# Altium project wisp-6.0V2.PrjPcb
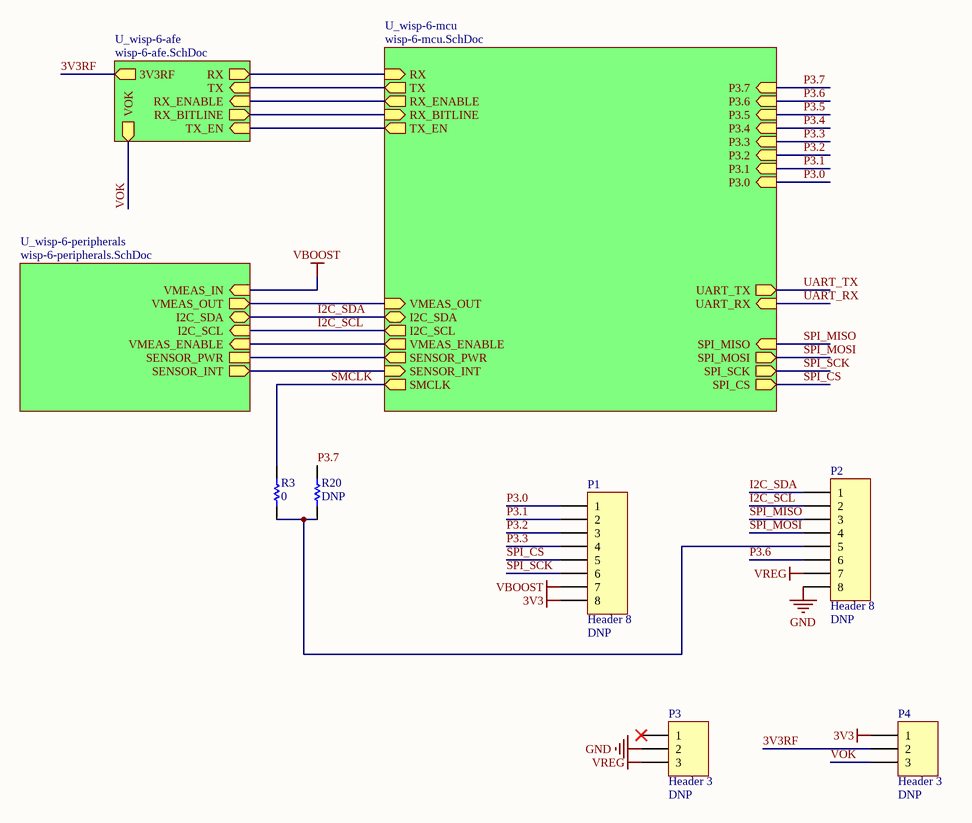
[diagram p0: wisp-6-main.SchDoc]
4 sheets, 84 parts. Net scope: hierarchical (ports join the sheet entries above them; power ports are global).
Board file: wisp-6-dipole.PcbDoc
Sheets:
  wisp-6-main.SchDoc
    U_wisp-6-mcu = wisp-6-mcu.SchDoc
    U_wisp-6-afe = wisp-6-afe.SchDoc
    U_wisp-6-peripherals = wisp-6-peripherals.SchDoc

## Sheet wisp-6-main.SchDoc: WISP-6.0
size B; SheetNumber: 1; SheetTotal: 4

### Parts
P1  Header 8  value DNP  [HDR1X8]
P2  Header 8  value DNP  [HDR1X8]
P3  Header 3  value DNP  [HDR1X3]
P4  Header 3  value DNP  [HDR1X3]
R3  value 0  [0402]  (hidden comment: Generic resistor)
R20  value DNP  [0402]  (hidden comment: Generic resistor)

### Sub-sheets
U_wisp-6-afe = wisp-6-afe.SchDoc: TX (in), RX_ENABLE (in), RX (out), RX_BITLINE (out), TX_EN (in), VOK (out), 3V3RF (out)
U_wisp-6-mcu = wisp-6-mcu.SchDoc: RX (in), TX (out), RX_ENABLE (out), VMEAS_ENABLE (out), I2C_SCL (out), I2C_SDA (bidir), VMEAS_OUT (in), P3.0 (in), P3.1 (in), P3.2 (in), P3.3 (in), P3.4 (in), P3.5 (in), P3.6 (in), P3.7 (in), SPI_CS (out), RX_BITLINE (in), UART_RX (in), UART_TX (out), SPI_SCK (out), SENSOR_PWR (out), SENSOR_INT (in), TX_EN (out), SMCLK (out), SPI_MISO (in), SPI_MOSI (out)
U_wisp-6-peripherals = wisp-6-peripherals.SchDoc: VMEAS_IN (in), VMEAS_OUT (out), VMEAS_ENABLE (in), I2C_SCL (in), I2C_SDA (bidir), SENSOR_INT (out), SENSOR_PWR

### Nets
3V3: P1.8 P4.1
3V3RF: P4.2 ; sheet U_wisp-6-afe/3V3RF
GND: P2.8 P3.2
SENSOR_PWR: sheet U_wisp-6-mcu/SENSOR_PWR, sheet U_wisp-6-peripherals/SENSOR_PWR
VBOOST: P1.7 ; sheet U_wisp-6-peripherals/VMEAS_IN
VREG: P2.7 P3.3
BITLINE: sheet U_wisp-6-mcu/RX_BITLINE, sheet U_wisp-6-afe/RX_BITLINE
I2C_SCL: P2.2 ; sheet U_wisp-6-mcu/I2C_SCL, sheet U_wisp-6-peripherals/I2C_SCL
I2C_SDA: P2.1 ; sheet U_wisp-6-mcu/I2C_SDA, sheet U_wisp-6-peripherals/I2C_SDA
P3.0: P1.1 ; sheet U_wisp-6-mcu/P3.0
P3.1: P1.2 ; sheet U_wisp-6-mcu/P3.1
P3.2: P1.3 ; sheet U_wisp-6-mcu/P3.2
P3.3: P1.4 ; sheet U_wisp-6-mcu/P3.3
P3.6: P2.6 ; sheet U_wisp-6-mcu/P3.6
P3.7: R20.2 ; sheet U_wisp-6-mcu/P3.7
RX: sheet U_wisp-6-mcu/RX, sheet U_wisp-6-afe/RX
SMCLK: R3.2 ; sheet U_wisp-6-mcu/SMCLK
SPI_CS: P1.5 ; sheet U_wisp-6-mcu/SPI_CS
SPI_MISO: P2.3 ; sheet U_wisp-6-mcu/SPI_MISO
SPI_MOSI: P2.4 ; sheet U_wisp-6-mcu/SPI_MOSI
SPI_SCK: P1.6 ; sheet U_wisp-6-mcu/SPI_SCK
VOK: P4.3 ; sheet U_wisp-6-afe/VOK  [project net V_BATOK_RF]
NetC11_2: sheet U_wisp-6-mcu/RX_ENABLE, sheet U_wisp-6-afe/RX_ENABLE
NetP2_5: P2.5 R3.1 R20.1
NetR24_2: sheet U_wisp-6-mcu/VMEAS_ENABLE, sheet U_wisp-6-peripherals/VMEAS_ENABLE
NetR25_1: sheet U_wisp-6-mcu/VMEAS_OUT, sheet U_wisp-6-peripherals/VMEAS_OUT
NetR27_2: sheet U_wisp-6-mcu/TX_EN, sheet U_wisp-6-afe/TX_EN
NetR28_1: sheet U_wisp-6-mcu/TX, sheet U_wisp-6-afe/TX
NetU4_16: sheet U_wisp-6-mcu/SENSOR_INT, sheet U_wisp-6-peripherals/SENSOR_INT

Not connected (* = marked no-connect by the designer): P3 1*

### Library data of the parts
P1 P2 = Header 8: Header, 8-Pin; LatestRevisionDate: 17-Jul-2002; LatestRevisionNote: Re-released for DXP Platform.; Publisher: Altium Limited
P3 P4 = Header 3: Header, 3-Pin; LatestRevisionDate: 17-Jul-2002; LatestRevisionNote: Re-released for DXP Platform.; Publisher: Altium Limited
R3 = R-0-0.063W-*-0402: RES 0 OHM JUMPER 1/16W 0402; Manufacturer: YAGEO; Manufacturer Part Number: RC0402JR-070RL; Digi-Key Part Number: 311-0.0JRCT-ND; Rating: 1/16W; Note: *; Tolerance: *
R20 = res: Chip Resistor (Surface Mount); Manufacturer: *; Manufacturer Part Number: *; Digi-Key Part Number: *; Rating: *; Note: *; Tolerance: *

## Sheet wisp-6-mcu.SchDoc: MCU
size B; SheetNumber: 2; SheetTotal: 4
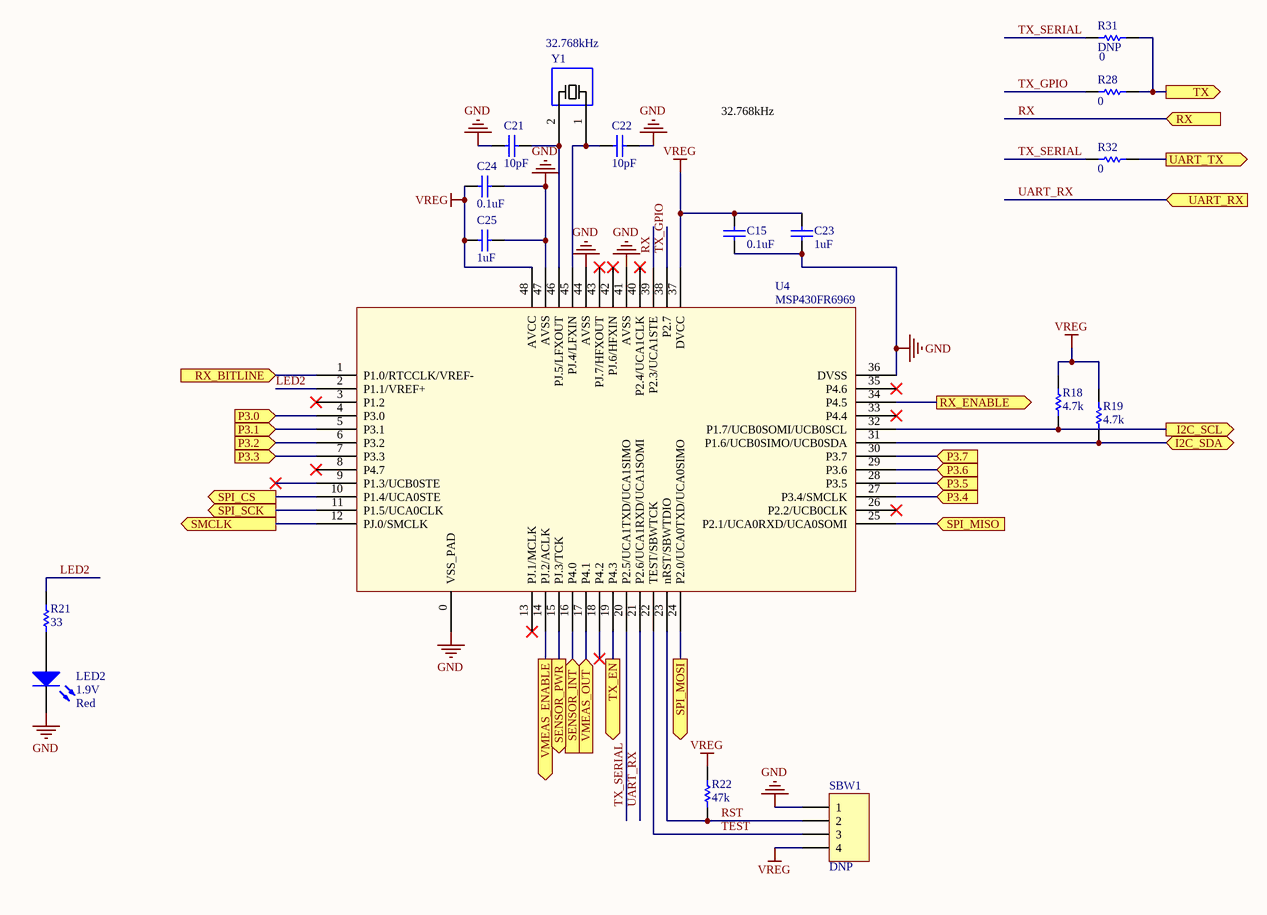
[diagram p1: wisp-6-mcu.SchDoc]

### Parts
C15  value 0.1uF  [0402]  (hidden comment: Generic ceramic capacitor)
C21  value 10pF  [0402]  (hidden comment: Generic ceramic capacitor)
C22  value 10pF  [0402]  (hidden comment: Generic ceramic capacitor)
C23  value 1uF  [0402]  (hidden comment: Generic ceramic capacitor)
C24  value 0.1uF  [0402]  (hidden comment: Generic ceramic capacitor)
C25  value 1uF  [0402]  (hidden comment: Generic ceramic capacitor)
LED2  value 1.9V  Color: Red  [Diode - 0603]  (hidden comment: Generic LED)
R18  value 4.7k  [0402]  (hidden comment: Generic resistor)
R19  value 4.7k  [0402]  (hidden comment: Generic resistor)
R21  value 33  [0402]  (hidden comment: Generic resistor)
R22  value 47k  [0402]  (hidden comment: Generic resistor)
R28  value 0  [0402]  (hidden comment: Generic resistor)
R31  value DNP  Note: 0  [0402]  (hidden comment: Generic resistor)
R32  value 0  [0402]  (hidden comment: Generic resistor)
SBW1  value DNP  [MHDR1X4]  (hidden comment: MHDR1X4)
U4  MSP430FR6969  [MSP_QFN48_RGZ_PAD0]
Y1  value 32.768kHz  [XTAL [3.20mm x 1.50mm]]  (hidden comment: XTAL 2 pin)

### Ports
I2C_SCL (out), I2C_SDA (bidir), P3.0 (in), P3.1 (in), P3.2 (in), P3.3 (in), P3.4 (in), P3.5 (in), P3.6 (in), P3.7 (in), RX (in), RX_BITLINE (in), RX_ENABLE (out), SENSOR_INT (in), SENSOR_PWR (out), SMCLK (out), SPI_CS (out), SPI_MISO (in), SPI_MOSI (out), SPI_SCK (out), TX (out), TX_EN (out), UART_RX (in), UART_TX (out), VMEAS_ENABLE (out), VMEAS_OUT (in)

### Nets
GND: C15.1 C21.1 C22.2 C23.1 C24.2 C25.2 LED2.2(K) SBW1.1 U4.0(VSS_PAD) U4.36(DVSS) U4.41(AVSS) U4.44(AVSS) U4.47(AVSS)
SENSOR_PWR: U4.15(PJ.3/TCK) ; port SENSOR_PWR
VREG: C15.2 C23.2 C24.1 C25.1 R18.2 R19.2 R22.2 SBW1.4 U4.37(DVCC) U4.48(AVCC)
BITLINE: U4.1(P1.0/RTCCLK/VREF-) ; port RX_BITLINE
I2C_SCL: R18.1 U4.32(P1.7/UCB0SOMI/UCB0SCL) ; port I2C_SCL
I2C_SDA: R19.1 U4.31(P1.6/UCB0SIMO/UCB0SDA) ; port I2C_SDA
LED2: R21.2 U4.2(P1.1/VREF+)
P3.0: U4.4(P3.0) ; port P3.0
P3.1: U4.5(P3.1) ; port P3.1
P3.2: U4.6(P3.2) ; port P3.2
P3.3: U4.7(P3.3) ; port P3.3
P3.4: U4.27(P3.4/SMCLK) ; port P3.4
P3.5: U4.28(P3.5) ; port P3.5
P3.6: U4.29(P3.6) ; port P3.6
P3.7: U4.30(P3.7) ; port P3.7
RST: R22.1 SBW1.2 U4.23(nRST/SBWTDIO)
RX: U4.39(P2.3/UCA1STE) ; port RX
SMCLK: U4.12(PJ.0/SMCLK) ; port SMCLK
SPI_CS: U4.10(P1.4/UCA0STE) ; port SPI_CS
SPI_MISO: U4.25(P2.1/UCA0RXD/UCA0SOMI) ; port SPI_MISO
SPI_MOSI: U4.24(P2.0/UCA0TXD/UCA0SIMO) ; port SPI_MOSI
SPI_SCK: U4.11(P1.5/UCA0CLK) ; port SPI_SCK
TEST: SBW1.3 U4.22(TEST/SBWTCK)
TX_GPIO: R28.2 U4.38(P2.7)
TX_SERIAL: R31.2 R32.2 U4.20(P2.5/UCA1TXD/UCA1SIMO)
UART_RX: U4.21(P2.6/UCA1RXD/UCA1SOMI) ; port UART_RX
UART_TX: R32.1 ; port UART_TX
NetC11_2: U4.34(P4.5) ; port RX_ENABLE
NetC21_2: C21.2 U4.46(PJ.5/LFXOUT) Y1.2
NetC22_1: C22.1 U4.45(PJ.4/LFXIN) Y1.1
NetLED2_1: LED2.1(A) R21.1
NetR24_2: U4.14(PJ.2/ACLK) ; port VMEAS_ENABLE
NetR25_1: U4.17(P4.1) ; port VMEAS_OUT
NetR27_2: U4.19(P4.3) ; port TX_EN
NetR28_1: R28.1 R31.1 ; port TX
NetU4_16: U4.16(P4.0) ; port SENSOR_INT

Not connected (* = marked no-connect by the designer): U4 3(P1.2)* 8(P4.7)* 9(P1.3/UCB0STE)* 13(PJ.1/MCLK)* 18(P4.2)* 26(P2.2/UCB0CLK)* 33(P4.4)* 35(P4.6)* 40(P2.4/UCA1CLK)* 42(PJ.6/HFXIN)* 43(PJ.7/HFXOUT)*

### Notes on the sheet
- 32.768kHz

### Library data of the parts
C15 C24 = C-0.1uF-10V-X5R-0402: CAP CER 100nF/0.1UF 10V X5R 0402; Manufacturer: Samsung Electro-Mechanics; Manufacturer Part Number: CL05A104KP5NNNC; Rating: 10V, -55C~85C; Tolerance: +-10%; Digi-Key Part Number: 1276-1022-1-ND; Note: *
C21 C22 = C-10pF-50V-C0G-0402: CAP CER 10PF 50V C0G/NP0 0402; Manufacturer: Samsung Electro-Mechanics; Manufacturer Part Number: CL05C100DB5NNNC; Rating: 10V, -55~125C; Tolerance: +-0.5pF; Digi-Key Part Number: 1276-1625-1-ND; Note: *
C23 C25 = C-1uF-10V-X5R-0402: CAP CER 1UF 10V X5R 0402; Manufacturer: Samsung Electro-Mechanics; Manufacturer Part Number: CL05A105KP5NNNC; Rating: 10V, -55~85C; Tolerance: +-10%; Digi-Key Part Number: 1276-1076-1-ND; Note: *
LED2 = led-red-1V9-0603: Red 629nm LED Indication - Discrete 1.9V 0603 (1608 Metric); Manufacturer: Lite-On Inc.; Manufacturer Part Number: LTST-C193KRKT-2A; Rating: 2A; Digi-Key Part Number: 160-1909-1-ND; Note: *; Tolerance: *
R18 R19 = R-4k7-0.063W-5%-0402: RES 4.7K OHM 5% 1/16W 0402; Manufacturer: YAGEO; Manufacturer Part Number: RC0402JR-074K7L; Tolerance: +-5%; Digi-Key Part Number: 311-4.7KJRCT-ND; Rating: 1/16W; Note: *
R21 = R-33-0.063W-5%-0402: 33 Ohms ±5% 0.063W, 1/16W Chip Resistor 0402 (1005 Metric) Moisture Resistant Thick Film; Manufacturer: YAGEO; Manufacturer Part Number: RC0402JR-1333RL; Tolerance: +-5%; Digi-Key Part Number: 13-RC0402JR-1333RLCT-ND; Rating: 1/16W; Note: *
R22 = R-47k-0.063W-5%-0402: RES 47K OHM 5% 1/16W 0402; Manufacturer: YAGEO; Manufacturer Part Number: RC0402JR-1047KL; Tolerance: +-5%; Digi-Key Part Number: 13-RC0402JR-1047KLCT-ND; Rating: 1/16W; Note: *
R28 R31 R32 = R-0-0.063W-*-0402: as R3 on sheet wisp-6-main; Digi-Key Part Number: 311-0.0JRCT-ND; Rating: 1/16W; Tolerance: *
  R28 R32: Note: 0
SBW1 = MHDR1X4: Header, 4-Pin; LatestRevisionDate: 17-Jul-2002; LatestRevisionNote: Re-released for DXP Platform.; Publisher: Altium Limited
U4 = MSP430FR596X_586X_RGZ: MSP430 CPUXV2 MSP430™ FRAM Microcontroller IC 16-Bit 16MHz 64KB (64K x 8) FRAM 48-VQFN (7x7); Manufacturer Part Number: MSP430FR5969IRGZT; Manufacturer: Texas Instruments; Rating: -40~85C; Digi-Key Part Number: 296-37918-1-ND; Note: *
Y1 = XTAL_2pin: 2-pin XTAL; Manufacturer Part Number: FC-135 32.7680KA-A3; Digi-Key Part Number: *; Manufacturer: *; Rating: *; Note: *

## Sheet wisp-6-afe.SchDoc: AFE
size B; SheetNumber: 3; SheetTotal: 4
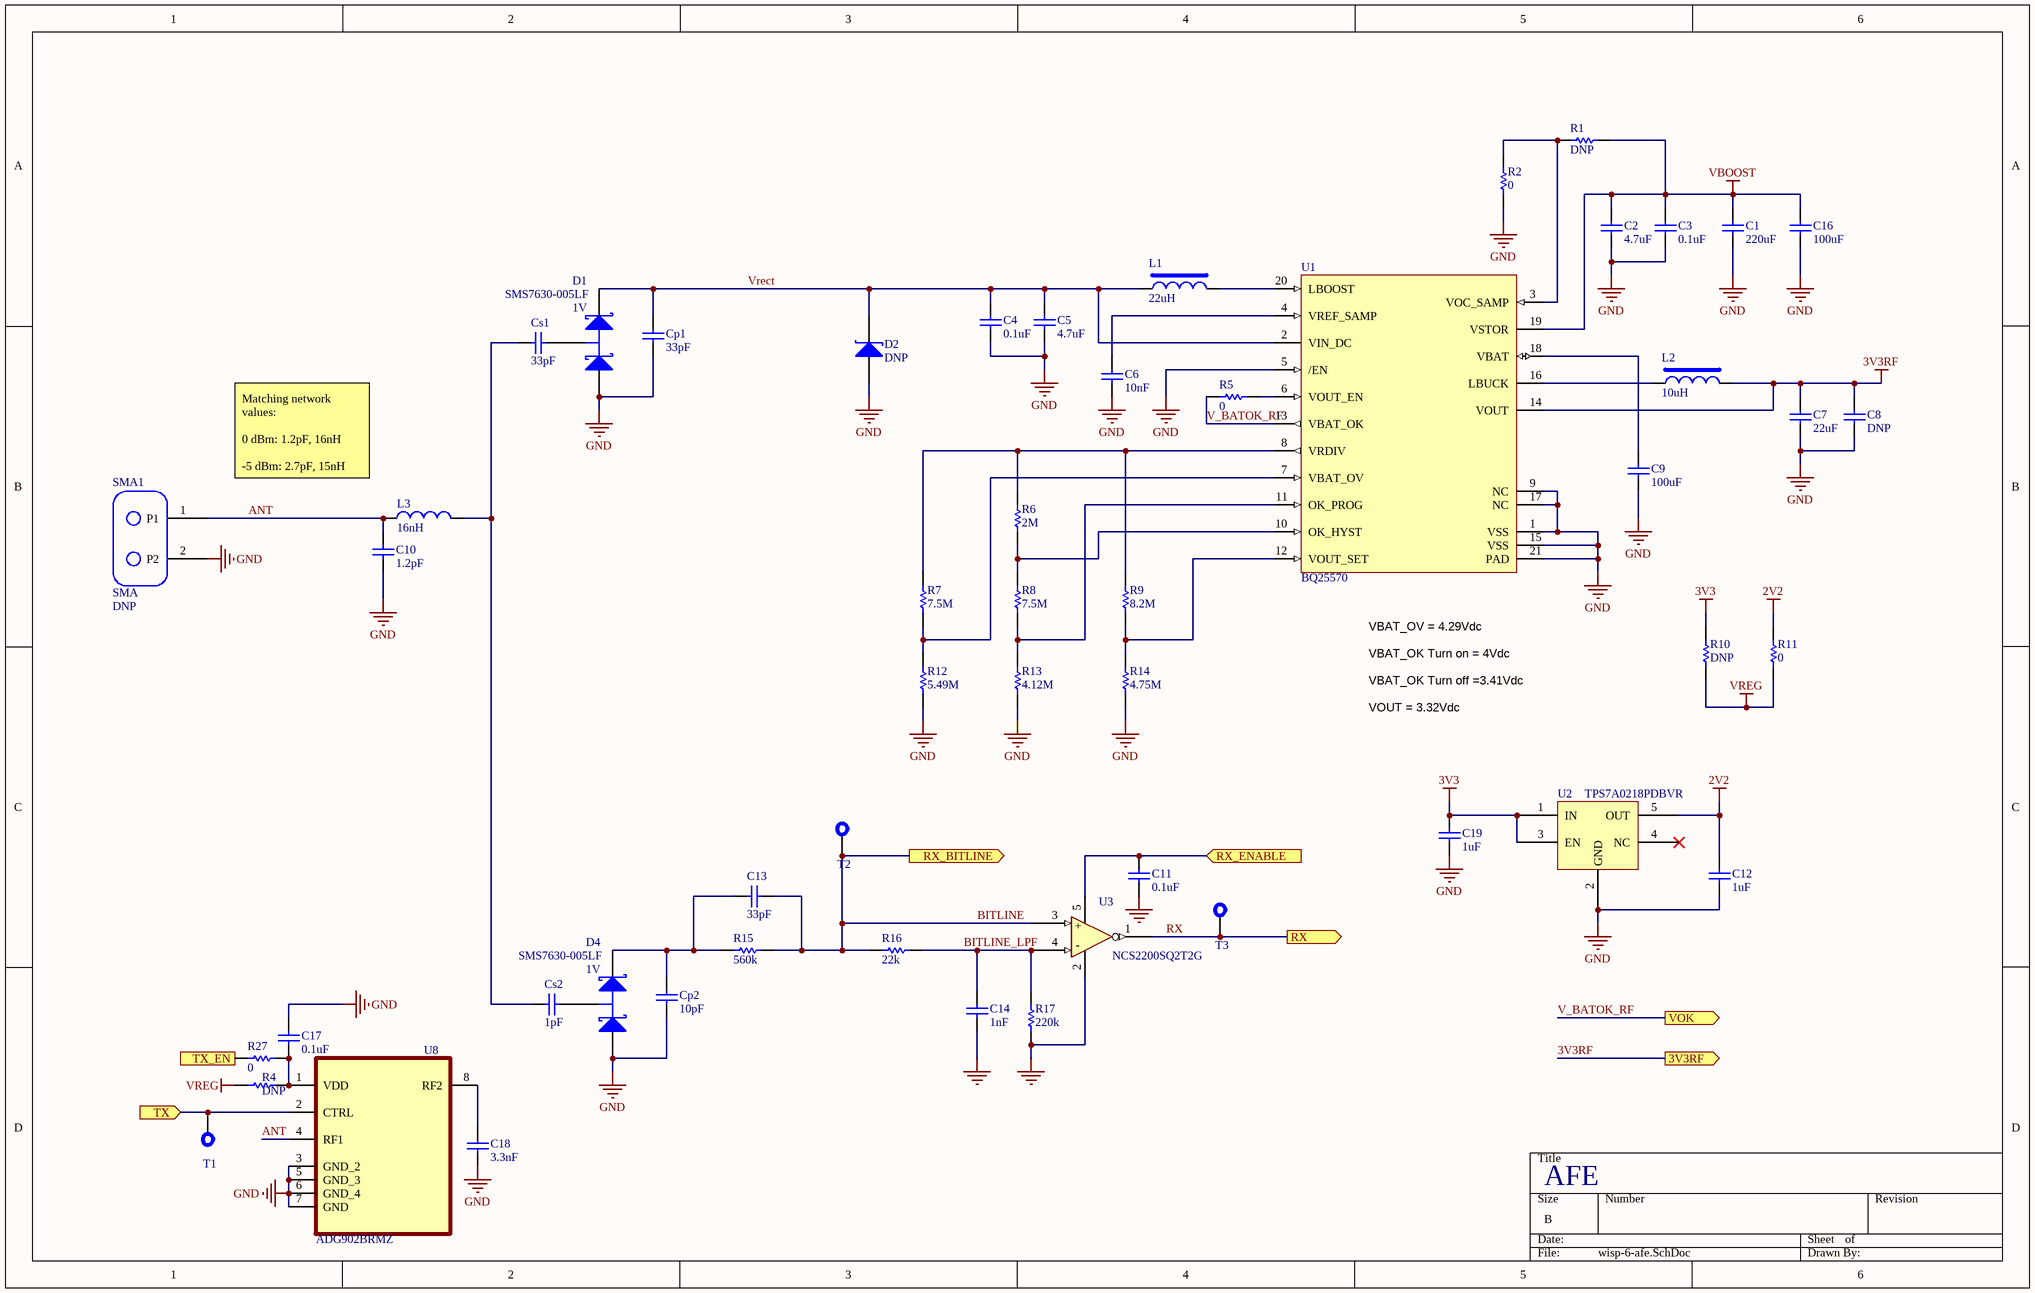
[diagram p2: wisp-6-afe.SchDoc]

### Parts
C1  value 220uF  [1206]  (hidden comment: Generic ceramic capacitor)
C2  value 4.7uF  [0402]  (hidden comment: Generic ceramic capacitor)
C3  value 0.1uF  [0402]  (hidden comment: Generic ceramic capacitor)
C4  value 0.1uF  [0402]  (hidden comment: Generic ceramic capacitor)
C5  value 4.7uF  [0402]  (hidden comment: Generic ceramic capacitor)
C6  value 10nF  [0402]  (hidden comment: Generic ceramic capacitor)
C7  value 22uF  [0402]  (hidden comment: Generic ceramic capacitor)
C8  value DNP  [0402]  (hidden comment: Generic capacitor)
C9  value 100uF  [0805]  (hidden comment: Generic ceramic capacitor)
C10  value 1.2pF  [0402]  (hidden comment: Generic capacitor)
C11  value 0.1uF  [0402]  (hidden comment: Generic ceramic capacitor)
C12  value 1uF  [0402]  (hidden comment: Generic ceramic capacitor)
C13  value 33pF  [0402]  (hidden comment: Generic capacitor)
C14  value 1nF  [0402]  (hidden comment: Generic ceramic capacitor)
C16  value 100uF  [0805]  (hidden comment: Generic ceramic capacitor)
C17  value 0.1uF  [0402]  (hidden comment: Generic ceramic capacitor)
C18  value 3.3nF  [0402]  (hidden comment: Generic capacitor)
C19  value 1uF  [0402]  (hidden comment: Generic ceramic capacitor)
Cp1  value 33pF  [0402]  (hidden comment: Generic capacitor)
Cp2  value 10pF  [0402]  (hidden comment: Generic capacitor)
Cs1  value 33pF  [0402]  (hidden comment: Generic capacitor)
Cs2  value 1pF  [0402]  (hidden comment: Generic capacitor)
D1  SMS7630-005LF  value 1V  [SOT23 - N]
D2  value DNP  [Zener_SOD-523]  (hidden comment: Generic diode - zener)
D4  SMS7630-005LF  value 1V  [SOT23 - N]
L1  value 22uH  [LPS4018]  (hidden comment: SMT shielded inductor)
L2  value 10uH  [IND1008]  (hidden comment: SMT shielded inductor)
L3  value 16nH  [0603]  (hidden comment: Generic inductor)
R1  value DNP  [0402]  (hidden comment: Generic resistor)
R2  value 0  [0402]  (hidden comment: Generic resistor)
R4  value DNP  [0402]  (hidden comment: Generic resistor)
R5  value 0  [0402]  (hidden comment: Generic resistor)
R6  value 2M  [0402]  (hidden comment: Generic resistor)
R7  value 7.5M  [0402]  (hidden comment: Generic resistor)
R8  value 7.5M  [0402]  (hidden comment: Generic resistor)
R9  value 8.2M  [0402]  (hidden comment: Generic resistor)
R10  value DNP  [0402]  (hidden comment: Generic resistor)
R11  value 0  [0402]  (hidden comment: Generic resistor)
R12  value 5.49M  [0402]  (hidden comment: Generic resistor)
R13  value 4.12M  [0402]  (hidden comment: Generic resistor)
R14  value 4.75M  [0402]  (hidden comment: Generic resistor)
R15  value 560k  [0402]  (hidden comment: Generic resistor)
R16  value 22k  [0402]  (hidden comment: Generic resistor)
R17  value 220k  [0402]  (hidden comment: Generic resistor)
R27  value 0  [0402]  (hidden comment: Generic resistor)
SMA1  SMA  value DNP  [SMA - Hole - 2 Pin]
T1  TP  [Test Point - Via]  (value not drawn)  (no BOM)
T2  TP  [Test Point - Via]  (value not drawn)  (no BOM)
T3  TP  [Test Point - Via]  (value not drawn)  (no BOM)
U1  BQ25570  [BQ25570]
U2  TPS7A0218PDBVR  [SOT23-5]
U3  NCS2200SQ2T2G  [SC70-5]
U8  ADG902BRMZ  [SOP65P490X110-8N]

### Ports
3V3RF (out), RX (out), RX_BITLINE (out), RX_ENABLE (in), TX (in), TX_EN (in), VOK (out)

### Nets
2V2: C12.2 R11.2 U2.5(OUT)
3V3: C19.2 R10.2 U2.1(IN) U2.3(EN)
3V3RF: C7.2 C8.2 L2.2 U1.14(VOUT) ; port 3V3RF
GND: C1.1 C2.1 C3.1 C4.1 C5.1 C6.1 C7.1 C8.1 C9.1 C10.1 C11.1 C12.1 C14.1 C16.1 C17.2 C18.1 C19.1 Cp1.2 Cp2.2 D1.1(A) D2.1(A) D4.1(A) R2.1 R12.1 R13.1 R14.1 R17.1 SMA1.2(P2) U1.1(VSS) U1.5(/EN) U1.9(NC) U1.15(VSS) U1.17(NC) U1.21(PAD) U2.2(GND) U3.2(Gnd) U8.3(GND_2) U8.5(GND_3) U8.6(GND_4) U8.7(GND)
VBOOST: C1.2 C2.2 C3.2 C16.2 R1.2 U1.19(VSTOR)
VREG: R4.2 R10.1 R11.1
ANT: C10.2 L3.1 SMA1.1(P1) U8.4(RF1)
BITLINE: C13.1 R15.2 R16.1 T2.0 U3.3(IN+) ; port RX_BITLINE
BITLINE_LPF: C14.2 R16.2 R17.2 U3.4(In-)
RX: T3.0 U3.1(OUT) ; port RX
V_BATOK_RF: R5.1 U1.13(VBAT_OK) ; port VOK
Vrect: C4.2 C5.2 Cp1.1 D1.2(K) D2.2(K) L1.1 U1.2(VIN_DC)
NetC6_2: C6.2 U1.4(VREF_SAMP)
NetC9_2: C9.2 U1.18(VBAT)
NetC11_2: C11.2 U3.5(VDD) ; port RX_ENABLE
NetC13_2: C13.2 Cp2.1 D4.2(K) R15.1
NetC17_1: C17.1 R4.1 R27.1 U8.1(VDD)
NetC18_2: C18.2 U8.8(RF2)
NetCs1_1: Cs1.1 D1.3(C)
NetCs1_2: Cs1.2 Cs2.2 L3.2
NetCs2_1: Cs2.1 D4.3(C)
NetL1_2: L1.2 U1.20(LBOOST)
NetL2_1: L2.1 U1.16(LBUCK)
NetR1_1: R1.1 R2.2 U1.3(VOC_SAMP)
NetR5_2: R5.2 U1.6(VOUT_EN)
NetR6_1: R6.1 R8.2 U1.10(OK_HYST)
NetR6_2: R6.2 R7.2 R9.2 U1.8(VRDIV)
NetR7_1: R7.1 R12.2 U1.7(VBAT_OV)
NetR8_1: R8.1 R13.2 U1.11(OK_PROG)
NetR9_1: R9.1 R14.2 U1.12(VOUT_SET)
NetR27_2: R27.2 ; port TX_EN
NetR28_1: T1.0 U8.2(CTRL) ; port TX

Not connected (* = marked no-connect by the designer): U2 4(NC)*

### Notes on the sheet
- Matching network values:
  0 dBm: 1.2pF, 16nH
  -5 dBm: 2.7pF, 15nH
- VBAT_OV = 4.29Vdc
- VBAT_OK Turn on = 4Vdc
- VBAT_OK Turn off =3.41Vdc
- VOUT = 3.32Vdc
- (in symbol NCS2200) +; -

### Library data of the parts
C1 = C-220uF-6V3-X5R-1206: CAP CER 220UF 6.3V X5R 1206; Manufacturer: Murata Electronics; Manufacturer Part Number: GRM31CR60J227ME11L; Rating: 6.3V, -55~85C; Tolerance: +-20%; Digi-Key Part Number: 490-13970-1-ND; Note: *
C2 C5 = C-4.7uF-10V-X5R-0402: CAP CER 4.7UF 10V X5R 0402; Manufacturer: Samsung Electro-Mechanics; Manufacturer Part Number: CL05A475MP5NRNC; Rating: 10V, -55~85C; Tolerance: +-20%; Digi-Key Part Number: 1276-1482-1-ND; Note: *
C3 C4 C11 C17 = C-0.1uF-10V-X5R-0402: as C15 on sheet wisp-6-mcu; Digi-Key Part Number: 1276-1022-1-ND; Note: *
C6 = C-10nF-50V-X7R-0402: 10000 pF ±10% 50V Ceramic Capacitor X7R 0402 (1005 Metric); Manufacturer: Samsung Electro-Mechanics; Manufacturer Part Number: CL05B103KB5NNNC; Rating: 50V, -55~125C; Tolerance: +-10%; Digi-Key Part Number: 1276-1028-1-ND; Note: *
C7 = C-22uF-6V3-X5R-0402: CAP CER 22UF 6.3V X5R 0402; Manufacturer: Samsung Electro-Mechanics; Manufacturer Part Number: CL05A226MQ5N6J8; Rating: 6.3V, -55~85C; Tolerance: +-20%; Digi-Key Part Number: 1276-7090-1-ND; Note: *
C8 = cap: Ceramic Capacitor (Surface Mount); Digi-Key Part Number: *; Manufacturer: *; Manufacturer Part Number: *; Note: *; Rating: *; Tolerance: *
C9 C16 = C-100uF-6V3-X5R-0805: CAP CER 100UF 6.3V X5R 0805; Manufacturer: Murata Electronics; Manufacturer Part Number: GRM21BR60J107ME15L; Rating: 6.3V, -55~85C; Tolerance: +-20%; Digi-Key Part Number: 490-13981-1-ND; Note: *
C10 = cap: Ceramic Capacitor (Surface Mount); Manufacturer: Johanson Technology Inc.; Manufacturer Part Number: QSCF500Q1R2A1GV001T; Rating: 50V, -55~150C; Tolerance: +-0.05pF; Digi-Key Part Number: 712-QSCF500Q1R2A1GV001TCT-ND; Note: *
C12 C19 = C-1uF-10V-X5R-0402: as C23 on sheet wisp-6-mcu; Digi-Key Part Number: 1276-1076-1-ND; Note: *
C13 Cp1 Cs1 = cap: Ceramic Capacitor (Surface Mount); Manufacturer: Johanson Technology Inc.; Manufacturer Part Number: QSCF500Q330F1GV001T; Rating: 50V, -55~150C; Tolerance: +-1%; Digi-Key Part Number: 712-QSCF500Q330F1GV001TCT-ND; Note: *
C14 = C-1nF-50V-C0G-0402: CAP CER 1000PF 50V C0G/NP0 0402; Manufacturer: Samsung Electro-Mechanics; Manufacturer Part Number: CL05C102JB5NNNC; Rating: 50V, -55~125C; Tolerance: +-5%; Digi-Key Part Number: 1276-1635-1-ND; Note: *
C18 = cap: Ceramic Capacitor (Surface Mount); Manufacturer: Murata Electronics; Manufacturer Part Number: GRM1555C1H332GE01D; Rating: 50V, -55~125C; Tolerance: +-2%; Digi-Key Part Number: 490-GRM1555C1H332GE01DCT-ND; Note: *
Cp2 = cap: Ceramic Capacitor (Surface Mount); Manufacturer: Johanson Technology Inc.; Manufacturer Part Number: QSCF500Q100F1GV001T; Rating: 50V, -55~150C; Tolerance: +-1%; Digi-Key Part Number: 712-QSCF500Q100F1GV001TCT-ND; Note: *
Cs2 = cap: Ceramic Capacitor (Surface Mount); Manufacturer: Johanson Technology Inc.; Manufacturer Part Number: QSCF500Q1R0B1GV001T; Rating: 50V, -55~150C; Tolerance: +-0.1pF; Digi-Key Part Number: 712-QSCF500Q1R0B1GV001TCT-ND; Note: *
D1 D4 = SMS7630-005LF: RF diode schottky / SOT-23 Series Pair / Ls=1.5nH; Manufacturer: Skyworks Solutions Inc.; Rating: 75mW, -65~150C; Manufacturer Part Number: SMS7630-005LF; Digi-Key Part Number: 863-1699-1-ND; Tolerance: *; Note: *
D2 = diode_zener: Diode - Zener; Manufacturer Part Number: *; Manufacturer: *; Digi-Key Part Number: *; Note: *; Tolerance: *; Rating: *
L1 = Ind-22uH-650mA-20%-LPS4018: 22 µH Shielded Drum Core Inductor 650 mA 360mOhm Max Nonstandard; Manufacturer: Coilcraft; Manufacturer Part Number: LPS4018-223MRC; Rating: 650mA; Tolerance: +-20%; Digi-Key Part Number: 2457-LPS4018-223MRC-ND; Note: *
L2 = Ind-10uH-800mA-20%-1008: FIXED IND 10UH 800MA 625 MOHM; Manufacturer: Würth Elektronik; Manufacturer Part Number: 74479889310; Tolerance: +-20%; Digi-Key Part Number: 732-74479889310CT-ND; Rating: 800mA; Note: *
L3 = ind: Inductor (Surface Mount); Manufacturer: Murata Electronics; Manufacturer Part Number: LQW18AS16NG00D; Rating: 700mA, -40~125C; Note: Equivalent to coilcraft 0603CS-16NXGL; Tolerance: +-2%; Digi-Key Part Number: 490-LQW18AS16NG00DCT-ND
R1 R4 R10 = res: Chip Resistor (Surface Mount); Manufacturer: *; Manufacturer Part Number: *; Digi-Key Part Number: *; Rating: *; Note: *; Tolerance: *
R2 R5 R11 R27 = R-0-0.063W-*-0402: as R3 on sheet wisp-6-main; Digi-Key Part Number: 311-0.0JRCT-ND; Rating: 1/16W; Note: *; Tolerance: *
R6 = R-2M-0.063W-1%-0402: RES 2M OHM 1% 1/16W 0402; Manufacturer: YAGEO; Manufacturer Part Number: RC0402FR-072ML; Tolerance: +-1%; Digi-Key Part Number: 13-RC0402FR-072MLCT-ND; Rating: 1/16W; Note: *
R7 R8 = R-7M5-0.063W-5%-0402: RES 7.5M OHM 5% 1/16W 0402; Manufacturer: YAGEO; Manufacturer Part Number: RC0402JR-077M5L; Tolerance: +-5%; Digi-Key Part Number: YAG3315CT-ND; Rating: 1/16W; Note: *
R9 = R-8M2-0.063W-1%-0402: 8.2 MOhms ±1% 0.063W, 1/16W Chip Resistor 0402 (1005 Metric) Moisture Resistant Thick Film; Manufacturer: YAGEO; Manufacturer Part Number: RC0402FR-078M2L; Tolerance: +-1%; Digi-Key Part Number: 13-RC0402FR-078M2LCT-ND; Rating: 1/16W; Note: *
R12 = R-5M49-0.063W-1%-0402: 5.49 MOhms ±1% 0.063W, 1/16W Chip Resistor 0402 (1005 Metric) Moisture Resistant Thick Film; Manufacturer: YAGEO; Manufacturer Part Number: RC0402FR-075M49L; Tolerance: +-1%; Digi-Key Part Number: 13-RC0402FR-075M49LCT-ND; Rating: 1/16W; Note: *
R13 = R-4M12-0.063W-1%-0402: RES 4.12M OHM 1% 1/16W 0402; Manufacturer: YAGEO; Manufacturer Part Number: RC0402FR-074M12L; Tolerance: +-1%; Digi-Key Part Number: 13-RC0402FR-074M12LCT-ND; Rating: 1/16W; Note: *
R14 = R-4M75-0.063W-1%-0402: RES 4.75M OHM 1% 1/16W 0402; Manufacturer: YAGEO; Manufacturer Part Number: RC0402FR-074M75L; Tolerance: +-1%; Digi-Key Part Number: 13-RC0402FR-074M75LCT-ND; Rating: 1/16W; Note: *
R15 = R-560k-0.063W-1%-0402: RES 560K OHM 1% 1/16W 0402; Manufacturer: YAGEO; Manufacturer Part Number: RC0402FR-07560KL; Tolerance: +-1%; Digi-Key Part Number: 311-560KLRCT-ND; Rating: 1/16W; Note: *
R16 = R-22k-0.063W-1%-0402: RES 22K OHM 1% 1/16W 0402; Manufacturer: YAGEO; Manufacturer Part Number: RC0402FR-0722KL; Tolerance: +-1%; Digi-Key Part Number: 311-22.0KLRCT-ND; Rating: 1/16W; Note: *
R17 = R-220k-0.063W-1%-0402: RES 220K OHM 1% 1/16W 0402; Manufacturer: YAGEO; Manufacturer Part Number: RC0402FR-07220KL; Tolerance: +-1%; Digi-Key Part Number: 311-220KLRCT-ND; Rating: 1/16W; Note: *
SMA1 = SMA - Hole - 2 Pin: Two pin SMA connector wisp; Note: *; Manufacturer: *; Digi-Key Part Number: *; Manufacturer Part Number: *; Rating: *
T1-T3 = Test Point Via: Test Point, via no BOM
U1 = BQ25570: Buck-boost charger Energy Harvesting PMIC 20-VQFN (3.5x3.5); Manufacturer: Texas Instruments; Manufacturer Part Number: BQ25570RGRT; Rating: -40~125C; Digi-Key Part Number: 296-37014-1-ND; Value: *; Note: *
U2 = TPS7A0218PDBVR: Linear Voltage Regulator IC Positive Fixed 1 Output 200mA SOT-23-5; Manufacturer: Texas Instruments; Rating: 6V in, -40~125C; Value: 1.8V; Manufacturer Part Number: TPS7A0218PDBVR; Note: *; Digi-Key Part Number: 296-TPS7A0218PDBVRCT-ND; Tolerance: *
U3 = NCS2200: Comparator Standard (General Purpose) Complementary, Rail-to-Rail SC-88A (SC-70-5/SOT-353); Manufacturer: onsemi; Rating: 6V max, -40~105C; Digi-Key Part Number: NCS2200SQ2T2GOSCT-ND; Manufacturer Part Number: NCS2200SQ2T2G; Value: *; Note: *
U8 = ADG902BRMZ: RF Switch IC General Purpose SPST 2.5GHz 50Ohm 8-MSOP; Manufacturer: Analog Devices; Rating: 1.65V~2.75Vcc, -40~85C; Digi-Key Part Number: ADG902BRMZ-ND; Manufacturer Part Number: ADG902BRMZ; Value: *; Note: *

## Sheet wisp-6-peripherals.SchDoc: Peripherals
size B; SheetNumber: 4; SheetTotal: 4
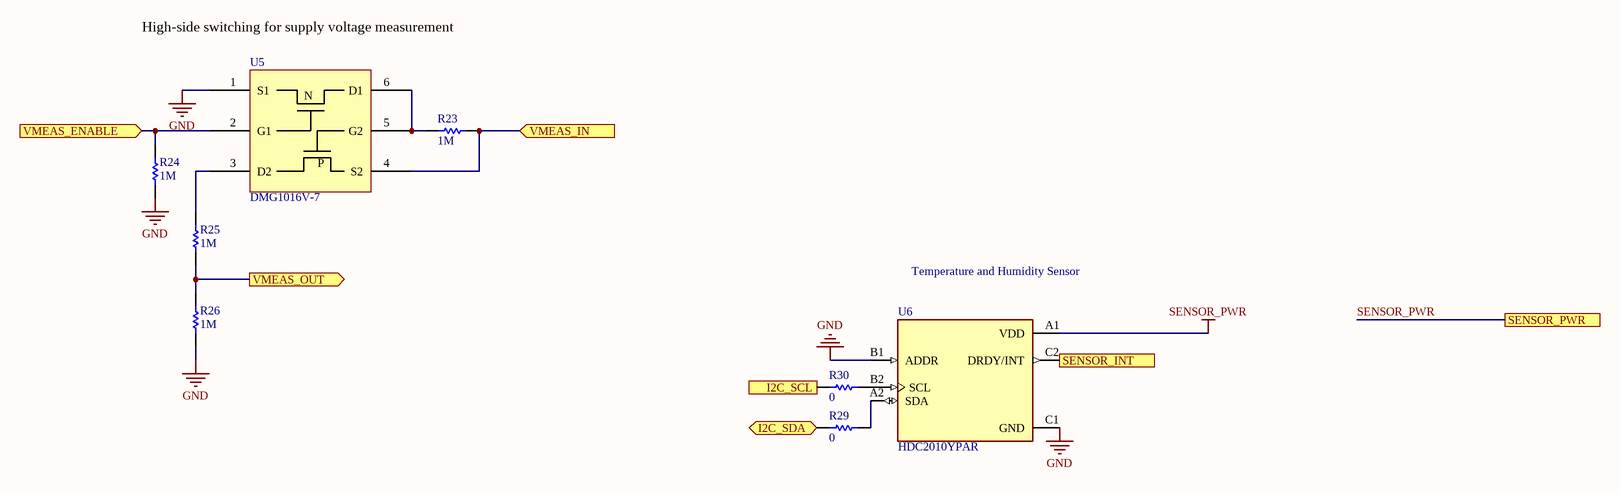
[diagram p3: wisp-6-peripherals.SchDoc]

### Parts
R23  value 1M  [0402]  (hidden comment: Generic resistor)
R24  value 1M  [0402]  (hidden comment: Generic resistor)
R25  value 1M  [0402]  (hidden comment: Generic resistor)
R26  value 1M  [0402]  (hidden comment: Generic resistor)
R29  value 0  [0402]  (hidden comment: Generic resistor)
R30  value 0  [0402]  (hidden comment: Generic resistor)
U5  DMG1016V-7  [SOT-563 Diodes Incorporated]
U6  HDC2010YPAR  [BGA6C100X50P2X3_HDC2010YPAR]

### Ports
I2C_SCL (in), I2C_SDA (bidir), SENSOR_INT (out), SENSOR_PWR, VMEAS_ENABLE (in), VMEAS_IN (in), VMEAS_OUT (out)

### Nets
GND: R24.1 R26.1 U5.1(S1) U6.B1(ADDR) U6.C1(GND)
SENSOR_PWR: U6.A1(VDD) ; port SENSOR_PWR
VBOOST: R23.2 U5.4(S2) ; port VMEAS_IN
I2C_SCL: R30.1 ; port I2C_SCL
I2C_SDA: R29.1 ; port I2C_SDA
NetR23_1: R23.1 U5.5(G2) U5.6(D1)
NetR24_2: R24.2 U5.2(G1) ; port VMEAS_ENABLE
NetR25_1: R25.1 R26.2 ; port VMEAS_OUT
NetR25_2: R25.2 U5.3(D2)
NetR29_2: R29.2 U6.A2(SDA)
NetR30_2: R30.2 U6.B2(SCL)
NetU4_16: U6.C2(DRDY/INT) ; port SENSOR_INT

### Notes on the sheet
- High-side switching for supply voltage measurement
- Temperature and Humidity Sensor
- (in symbol DMG1016V-7) N; P

### Library data of the parts
R23-R26 = R-1M-0.063W-5%-0402: RES 1M OHM 5% 1/16W 0402; Manufacturer: YAGEO; Manufacturer Part Number: RC0402JR-071ML; Tolerance: +-5%; Digi-Key Part Number: 311-1.0MJRCT-ND; Rating: 1/16W; Note: *
R29 R30 = R-0-0.063W-*-0402: as R3 on sheet wisp-6-main; Digi-Key Part Number: 311-0.0JRCT-ND; Rating: 1/16W; Note: *; Tolerance: *
U5 = DMG1016V-7: MOSFET N/P-CH 20V 0.87A SOT563; Manufacturer: Diodes Incorporated; Rating: 530mW, -55~150C; Digi-Key Part Number: DMG1016V-7DICT-ND; Manufacturer Part Number: DMG1016V-7; Tolerance: *; Note: *
U6 = HDC2010YPAR: Humidity, Temperature 0 ~ 100% RH I2C ±2% 8 s Surface Mount; Manufacturer: Texas Instruments; Rating: -40~85C; Manufacturer Part Number: HDC2010YPAR; Value: *; Digi-Key Part Number: 296-47774-1-ND; Note: *

## Nets that join several sheets
3V3: wisp-6-main (P1.8 P4.1), wisp-6-afe (C19.2 R10.2 U2.1 U2.3)
3V3RF: wisp-6-main (P4.2), wisp-6-afe (C7.2 C8.2 L2.2 U1.14)
GND: wisp-6-main (P2.8 P3.2), wisp-6-mcu (13 pins), wisp-6-afe (40 pins), wisp-6-peripherals (5 pins)
SENSOR_PWR: wisp-6-mcu (U4.15), wisp-6-peripherals (U6.A1)
VBOOST: wisp-6-main (P1.7), wisp-6-afe (6 pins), wisp-6-peripherals (R23.2 U5.4)
VREG: wisp-6-main (P2.7 P3.3), wisp-6-mcu (10 pins), wisp-6-afe (R4.2 R10.1 R11.1)
BITLINE: wisp-6-mcu (U4.1), wisp-6-afe (5 pins)
I2C_SCL: wisp-6-main (P2.2), wisp-6-mcu (R18.1 U4.32), wisp-6-peripherals (R30.1)
I2C_SDA: wisp-6-main (P2.1), wisp-6-mcu (R19.1 U4.31), wisp-6-peripherals (R29.1)
NetC11_2: wisp-6-mcu (U4.34), wisp-6-afe (C11.2 U3.5)
NetR24_2: wisp-6-mcu (U4.14), wisp-6-peripherals (R24.2 U5.2)
NetR25_1: wisp-6-mcu (U4.17), wisp-6-peripherals (R25.1 R26.2)
NetR27_2: wisp-6-mcu (U4.19), wisp-6-afe (R27.2)
NetR28_1: wisp-6-mcu (R28.1 R31.1), wisp-6-afe (T1.0 U8.2)
NetU4_16: wisp-6-mcu (U4.16), wisp-6-peripherals (U6.C2)
P3.0: wisp-6-main (P1.1), wisp-6-mcu (U4.4)
P3.1: wisp-6-main (P1.2), wisp-6-mcu (U4.5)
P3.2: wisp-6-main (P1.3), wisp-6-mcu (U4.6)
P3.3: wisp-6-main (P1.4), wisp-6-mcu (U4.7)
P3.6: wisp-6-main (P2.6), wisp-6-mcu (U4.29)
P3.7: wisp-6-main (R20.2), wisp-6-mcu (U4.30)
RX: wisp-6-mcu (U4.39), wisp-6-afe (T3.0 U3.1)
SMCLK: wisp-6-main (R3.2), wisp-6-mcu (U4.12)
SPI_CS: wisp-6-main (P1.5), wisp-6-mcu (U4.10)
SPI_MISO: wisp-6-main (P2.3), wisp-6-mcu (U4.25)
SPI_MOSI: wisp-6-main (P2.4), wisp-6-mcu (U4.24)
SPI_SCK: wisp-6-main (P1.6), wisp-6-mcu (U4.11)
V_BATOK_RF: wisp-6-main (P4.3), wisp-6-afe (R5.1 U1.13)